# Altium project Smoke_Detector.PrjPcb (part 4 of 4)
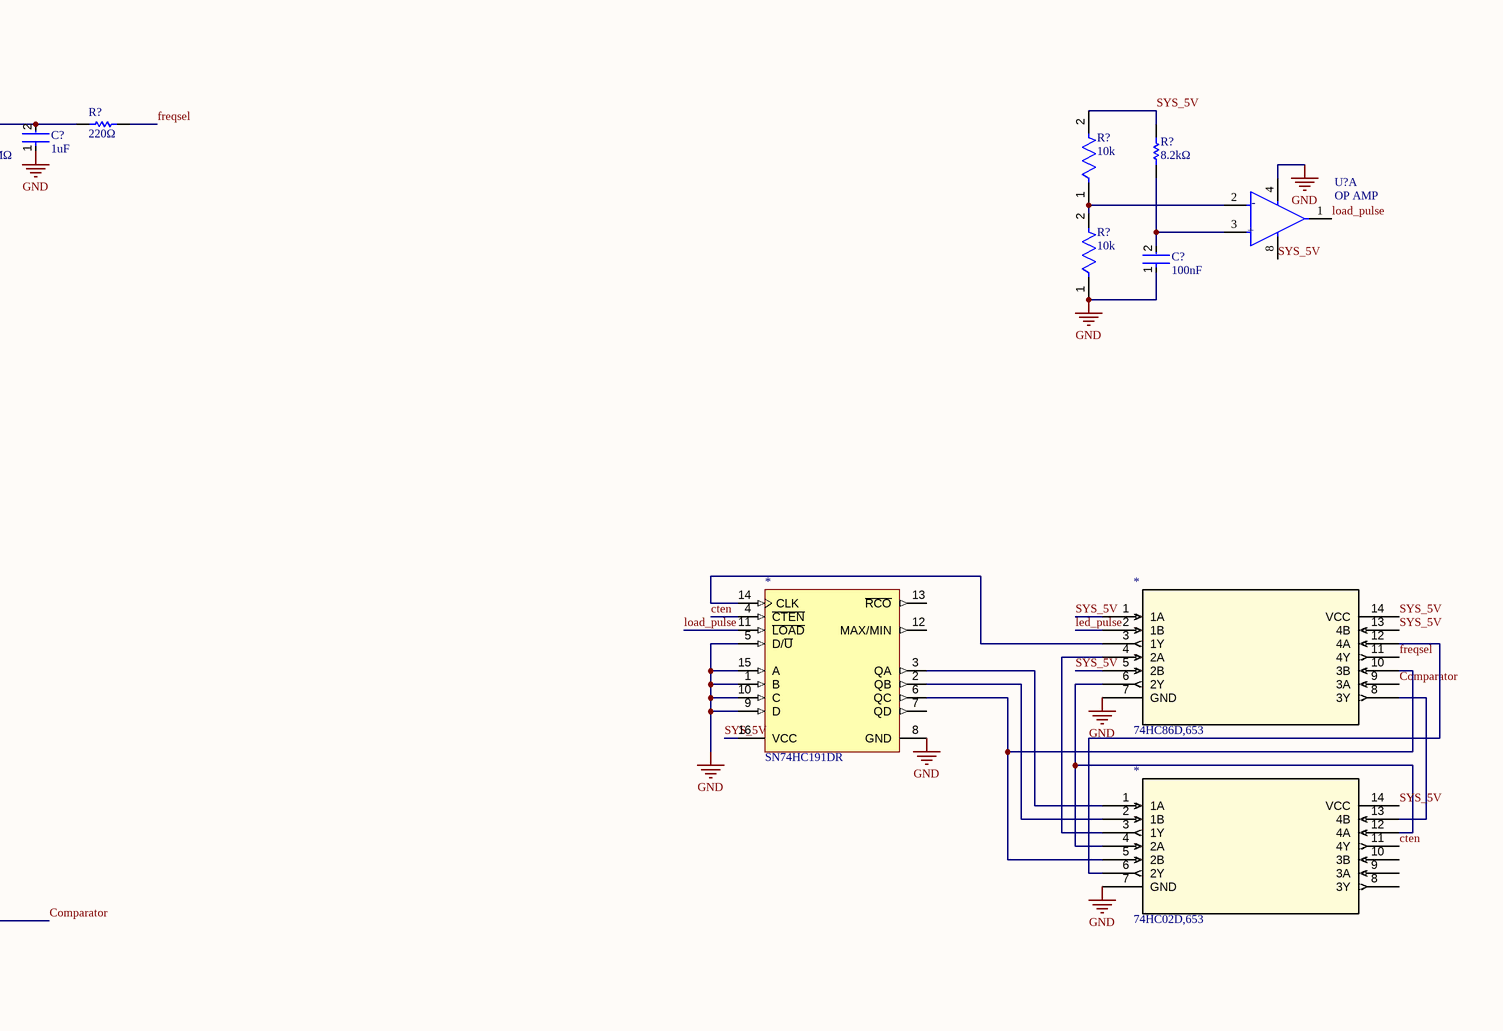
[diagram p4: Sheet1.SchDoc, right]

## Sheet Sheet1.SchDoc (continued)

### Library data of the parts (continued)
R?#8 R?#13 R?#22 R?#23 R?#27 R?#29 R?#30 = CRCW080510K0FKEA: RES SMD 10K OHM 1% 1/8W 0805; Manufacturer: Vishay; Manufacturer Package Identifier: CRCW0805-e3; Power Rating: 125mW; Value: 10kΩ; Temperature Coefficient: 100ppm/°C; Voltage Rating: 150V; Supplier: Future Electronics; Supplier Part Number: CRCW080510K0FKEA; Manufacturer Part Number: CRCW080510K0FKEA; RoHS: Compliant; Category: Chip SMD Resistors; Stock: 5460000; Pricing: 10000=0.0023, 50000=0.0022, 125000=0.0022, 375000=0.0021, 750000=0.002 (USD); Case/Package: 0805; Case Code (Imperial): 0805; China RoHS: Non-Compliant; Composition: Thick Film; Contact Plating: Tin; Country of Origin: Israel; Depth: 1.25mm; Export Control Classification Number (ECCN) Code: EAR99; Height: 450µm; Harmonized Tariff Schedule (HTS) Code: 8533.21.00.30; Introduction Date: 2005-02-16; Lead Free: Lead Free; Length: 2mm; Lifecycle Status: Production; Max Operating Temperature: 155°C; Military Standard: Not; Min Operating Temperature: -55°C; Mounting Technology: Surface Mount; Pins: 2; Number of Terminals: 2; Packaging: Cut Tape; Radiation Hardening: No; Ratings: AEC-Q200; REACH SVHC: Unaffected; Schedule B: 8533210045, 8533210045|8533210045|8533210045|8533210045|8533210045|8533210045|8533210045|8533210045|8533210045|8533210045|8533210045|8533210045|8533210045|8533210045|8533210045|8533210045|8533210045|8533210045|8533210045|8533210045|8533210045|8533210045|8533210045|85; Termination: SMD/SMT; Tolerance: 1%; Voltage Rating (DC): 150V; Weight: 5.499807mg; Width: 1.25mm; Working Voltage: 150V; ComponentLink1URL: https://datasheet.octopart.com:443/CRCW080510K0FKEA-Vishay-datasheet-175423584.pdf?src-supplier=IHS; ComponentLink1Description: https://datasheet.octopart.com:443/CRCW080510K0FKEA-Vishay-datasheet-175423584.pdf?src-supplier=IHS; ComponentLink2URL: https://datasheet.octopart.com:443/CRCW080510K0FKEA-Vishay-datasheet-5300368.pdf?src-supplier=Future+Electronics; ComponentLink2Description: https://datasheet.octopart.com:443/CRCW080510K0FKEA-Vishay-datasheet-5300368.pdf?src-supplier=Future+Electronics; ComponentLink3URL: https://datasheet.octopart.com:443/CRCW080510K0FKEA-Vishay-datasheet-62316122.pdf?src-supplier=Future+Electronics; ComponentLink3Description: https://datasheet.octopart.com:443/CRCW080510K0FKEA-Vishay-datasheet-62316122.pdf?src-supplier=Future+Electronics; ComponentLink4URL: https://datasheet.octopart.com:443/CRCW080510K0FKEA-Vishay-datasheet-83961561.pdf?src-supplier=Newark; ComponentLink4Description: https://datasheet.octopart.com:443/CRCW080510K0FKEA-Vishay-datasheet-83961561.pdf?src-supplier=Newark; ComponentLink5URL: https://datasheet.octopart.com:443/CRCW080510K0FKEA-Vishay-datasheet-14722531.pdf?src-supplier=Newark; ComponentLink5Description: https://datasheet.octopart.com:443/CRCW080510K0FKEA-Vishay-datasheet-14722531.pdf?src-supplier=Newark; ComponentLink6URL: https://datasheet.octopart.com:443/CRCW080510K0FKEA-Vishay-datasheet-62317937.pdf?src-supplier=Newark; ComponentLink6Description: https://datasheet.octopart.com:443/CRCW080510K0FKEA-Vishay-datasheet-62317937.pdf?src-supplier=Newark; ComponentLink7URL: https://datasheet.octopart.com:443/CRCW080510K0FKEA-Vishay-datasheet-11516975.pdf?src-supplier=Newark; ComponentLink7Description: https://datasheet.octopart.com:443/CRCW080510K0FKEA-Vishay-datasheet-11516975.pdf?src-supplier=Newark; ComponentLink8URL: https://datasheet.octopart.com:443/CRCW080510K0FKEA-Vishay-datasheet-183883877.pdf?src-supplier=Newark; ComponentLink8Description: https://datasheet.octopart.com:443/CRCW080510K0FKEA-Vishay-datasheet-183883877.pdf?src-supplier=Newark; ComponentLink9URL: https://datasheet.octopart.com:443/CRCW080510K0FKEA-Vishay-datasheet-41302739.pdf?src-supplier=Newark; ComponentLink9Description: https://datasheet.octopart.com:443/CRCW080510K0FKEA-Vishay-datasheet-41302739.pdf?src-supplier=Newark; ComponentLink10URL: https://datasheet.octopart.com:443/CRCW080510K0FKEA-Vishay-datasheet-27121962.pdf?src-supplier=Newark; ComponentLink10Description: https://datasheet.octopart.com:443/CRCW080510K0FKEA-Vishay-datasheet-27121962.pdf?src-supplier=Newark; ComponentLink11URL: https://datasheet.octopart.com:443/CRCW080510K0FKEA-Vishay-datasheet-16179825.pdf?src-supplier=element14+APAC; ComponentLink11Description: https://datasheet.octopart.com:443/CRCW080510K0FKEA-Vishay-datasheet-16179825.pdf?src-supplier=element14+APAC; ComponentLink12URL: https://datasheet.octopart.com:443/CRCW080510K0FKEA-Vishay-datasheet-66077789.pdf?src-supplier=element14+APAC; ComponentLink12Description: https://datasheet.octopart.com:443/CRCW080510K0FKEA-Vishay-datasheet-66077789.pdf?src-supplier=element14+APAC; ComponentLink13URL: https://datasheet.octopart.com:443/CRCW080510K0FKEA-Vishay-datasheet-5306405.pdf?src-supplier=RS+(Formerly+Allied+Electronics); ComponentLink13Description: https://datasheet.octopart.com:443/CRCW080510K0FKEA-Vishay-datasheet-5306405.pdf?src-supplier=RS+(Formerly+Allied+Electronics); ComponentLink14URL: https://datasheet.octopart.com:443/CRCW080510K0FKEA-Vishay-Dale-datasheet-47688880.pdf?src-supplier=RS+(Formerly+Allied+Electronics); ComponentLink14Description: https://datasheet.octopart.com:443/CRCW080510K0FKEA-Vishay-Dale-datasheet-47688880.pdf?src-supplier=RS+(Formerly+Allied+Electronics); ComponentLink15URL: https://datasheet.octopart.com:443/CRCW080510K0FKEA-Vishay-datasheet-12001583.pdf?src-supplier=RS+(Formerly+Allied+Electronics); ComponentLink15Description: https://datasheet.octopart.com:443/CRCW080510K0FKEA-Vishay-datasheet-12001583.pdf?src-supplier=RS+(Formerly+Allied+Electronics); ComponentLink16URL: https://datasheet.octopart.com:443/CRCW080510K0FKEA-Vishay-datasheet-17834126.pdf?src-supplier=TME; ComponentLink16Description: https://datasheet.octopart.com:443/CRCW080510K0FKEA-Vishay-datasheet-17834126.pdf?src-supplier=TME; ComponentLink17URL: https://datasheet.octopart.com/D-CRCW-e3-Standard-Thick-Film-Chip-Resistors-Vishay-datasheet-family-64.pdf; ComponentLink17Description: https://datasheet.octopart.com/D-CRCW-e3-Standard-Thick-Film-Chip-Resistors-Vishay-datasheet-family-64.pdf; ComponentLink18URL: https://datasheet.octopart.com:443/CRCW080510K0FKEA-Vishay-datasheet-13242068.pdf?src-supplier=Farnell; ComponentLink18Description: https://datasheet.octopart.com:443/CRCW080510K0FKEA-Vishay-datasheet-13242068.pdf?src-supplier=Farnell; ComponentLink19URL: https://datasheet.octopart.com:443/CRCW080510K0FKEA-Vishay-datasheet-13195083.pdf?src-supplier=Farnell; ComponentLink19Description: https://datasheet.octopart.com:443/CRCW080510K0FKEA-Vishay-datasheet-13195083.pdf?src-supplier=Farnell; ComponentLink20URL: https://datasheet.octopart.com:443/CRCW080510K0FKEA-Vishay-datasheet-13034211.pdf?src-supplier=Farnell; ComponentLink20Description: https://datasheet.octopart.com:443/CRCW080510K0FKEA-Vishay-datasheet-13034211.pdf?src-supplier=Farnell; ComponentLink21URL: https://datasheet.octopart.com:443/CRCW080510K0FKEA-Vishay-datasheet-12600034.pdf?src-supplier=Farnell; ComponentLink21Description: https://datasheet.octopart.com:443/CRCW080510K0FKEA-Vishay-datasheet-12600034.pdf?src-supplier=Farnell; ComponentLink22URL: https://datasheet.octopart.com:443/CRCW080510K0FKEA-Vishay-datasheet-12532161.pdf?src-supplier=Farnell; ComponentLink22Description: https://datasheet.octopart.com:443/CRCW080510K0FKEA-Vishay-datasheet-12532161.pdf?src-supplier=Farnell; ComponentLink23URL: https://datasheet.octopart.com:443/CRCW080510K0FKEA-Vishay-datasheet-12517896.pdf?src-supplier=Farnell; ComponentLink23Description: https://datasheet.octopart.com:443/CRCW080510K0FKEA-Vishay-datasheet-12517896.pdf?src-supplier=Farnell; ComponentLink24URL: https://datasheet.octopart.com:443/CRCW080510K0FKEA-Vishay-datasheet-12509762.pdf?src-supplier=Farnell; ComponentLink24Description: https://datasheet.octopart.com:443/CRCW080510K0FKEA-Vishay-datasheet-12509762.pdf?src-supplier=Farnell; ComponentLink25URL: https://datasheet.octopart.com:443/CRCW080510K0FKEA-Vishay-datasheet-10322335.pdf?src-supplier=Farnell; ComponentLink25Description: https://datasheet.octopart.com:443/CRCW080510K0FKEA-Vishay-datasheet-10322335.pdf?src-supplier=Farnell; ComponentLink26URL: https://datasheet.octopart.com:443/CRCW080510K0FKEA-Vishay-datasheet-8788789.pdf?src-supplier=Farnell; ComponentLink26Description: https://datasheet.octopart.com:443/CRCW080510K0FKEA-Vishay-datasheet-8788789.pdf?src-supplier=Farnell; ComponentLink27URL: https://datasheet.octopart.com:443/CRCW080510K0FKEA-Vishay-datasheet-8361388.pdf?src-supplier=Farnell; ComponentLink27Description: https://datasheet.octopart.com:443/CRCW080510K0FKEA-Vishay-datasheet-8361388.pdf?src-supplier=Farnell; ComponentLink28URL: https://datasheet.octopart.com:443/CRCW080510K0FKEA-Vishay-datasheet-546287.pdf?src-supplier=Farnell; ComponentLink28Description: https://datasheet.octopart.com:443/CRCW080510K0FKEA-Vishay-datasheet-546287.pdf?src-supplier=Farnell; ComponentLink29URL: https://datasheet.octopart.com:443/CRCW080510K0FKEA-Vishay-datasheet-11540273.pdf?src-supplier=Arrow+Electronics; ComponentLink29Description: https://datasheet.octopart.com:443/CRCW080510K0FKEA-Vishay-datasheet-11540273.pdf?src-supplier=Arrow+Electronics; ComponentLink30URL: https://datasheet.octopart.com:443/CRCW080510K0FKEA-Vishay-datasheet-8445837.pdf?src-supplier=element14; ComponentLink30Description: https://datasheet.octopart.com:443/CRCW080510K0FKEA-Vishay-datasheet-8445837.pdf?src-supplier=element14; ComponentLink31URL: https://datasheet.octopart.com:443/CRCW080510K0FKEA-Vishay-datasheet-5377306.pdf?src-supplier=Garrett; ComponentLink31Description: https://datasheet.octopart.com:443/CRCW080510K0FKEA-Vishay-datasheet-5377306.pdf?src-supplier=Garrett; ComponentLink32URL: https://datasheet.octopart.com:443/CRCW080510K0FKEA-Vishay-datasheet-148188.pdf?src-supplier=Garrett; ComponentLink32Description: https://datasheet.octopart.com:443/CRCW080510K0FKEA-Vishay-datasheet-148188.pdf?src-supplier=Garrett; ComponentLink33URL: https://datasheet.octopart.com:443/CRCW080510K0FKEA-Vishay-datasheet-34203.pdf?src-supplier=Garrett; ComponentLink33Description: https://datasheet.octopart.com:443/CRCW080510K0FKEA-Vishay-datasheet-34203.pdf?src-supplier=Garrett; ComponentLink34URL: http://sigma.octopart.com:80/rohs_certificate/D-CRCW-e3-Standard-Thick-Film-Chip-Resistors-Vishay-family-102.pdf?src-supplier=Compliance+Statements; ComponentLink34Description: http://sigma.octopart.com:80/rohs_certificate/D-CRCW-e3-Standard-Thick-Film-Chip-Resistors-Vishay-family-102.pdf?src-supplier=Compliance+Statements
R?#9 = RC0805FR-07470RL: RES SMD 470 OHM 1% 1/8W 0805; Manufacturer: Yageo Group; Max Power Dissipation: 125mW; Value: 470Ω; Temperature Coefficient: 100ppm/°C; Voltage Rating: 150V; Supplier: Future Electronics; Supplier Part Number: RC0805FR-07470RL; Manufacturer Part Number: RC0805FR-07470RL; RoHS: Compliant; Category: Chip SMD Resistors; Stock: 335000; Pricing: 5000=0.0068, 20000=0.0066, 75000=0.0064, 150000=0.0063, 375000=0.006 (USD); Case/Package: 0805; Case Code (Imperial): 0805; China RoHS: Non-Compliant; Composition: Thick Film; Contact Plating: Tin; Country of Origin: Mainland China, Taiwan; Depth: 1.25mm; Export Control Classification Number (ECCN) Code: EAR99; Features: Moisture Resistant; Height: 500µm; Harmonized Tariff Schedule (HTS) Code: 8533.21.00.30; Introduction Date: 2004-09-22; Lead Free: Lead Free; Lead Pitch: 400µm; Length: 2mm; Lifecycle Status: Production; Max Operating Temperature: 155°C; Military Standard: Not; Min Operating Temperature: -55°C; Mounting Technology: Surface Mount; Pins: 2; Number of Terminals: 2; Number of Terminations: 2; Packaging: Tape & Reel; Power Rating: 125mW; Radiation Hardening: No; REACH SVHC: Unaffected; Schedule B: 8533210045, 8533210045|8533210045|8533210045|8533210045|8533210045|8533210045|8533210045|8533210045|8533210045|8533210045|8533210045|8533210045|8533210045|8533210045|8533210045|8533210045|8533210045|8533210045|8533210045|8533210045|8533210045|8533210045|8533210045|85; Termination: SMD/SMT; Tolerance: 1%; Voltage Rating (AC): 150V; Voltage Rating (DC): 150V; Width: 1.25mm; Working Voltage: 150V; ComponentLink1URL: https://datasheet.octopart.com:443/RC0805FR-07470RL-Yageo-datasheet-175887523.pdf?src-supplier=Newark; ComponentLink1Description: https://datasheet.octopart.com:443/RC0805FR-07470RL-Yageo-datasheet-175887523.pdf?src-supplier=Newark; ComponentLink2URL: https://datasheet.octopart.com:443/RC0805FR-07470RL-Yageo-Group-datasheet-190051977.pdf?src-supplier=Newark; ComponentLink2Description: https://datasheet.octopart.com:443/RC0805FR-07470RL-Yageo-Group-datasheet-190051977.pdf?src-supplier=Newark; ComponentLink3URL: https://datasheet.octopart.com:443/RC0805FR-07470RL-Yageo-datasheet-103092701.pdf?src-supplier=Upverter; ComponentLink3Description: https://datasheet.octopart.com:443/RC0805FR-07470RL-Yageo-datasheet-103092701.pdf?src-supplier=Upverter; ComponentLink4URL: https://datasheet.octopart.com:443/RC0805FR-07470RL-Yageo-datasheet-98239111.pdf?src-supplier=Upverter; ComponentLink4Description: https://datasheet.octopart.com:443/RC0805FR-07470RL-Yageo-datasheet-98239111.pdf?src-supplier=Upverter; ComponentLink5URL: https://datasheet.octopart.com:443/RC0805FR-07470RL-Yageo-datasheet-8330313.pdf?src-supplier=element14+APAC; ComponentLink5Description: https://datasheet.octopart.com:443/RC0805FR-07470RL-Yageo-datasheet-8330313.pdf?src-supplier=element14+APAC; ComponentLink6URL: https://datasheet.octopart.com:443/RC0805FR-07470RL-Yageo-datasheet-62067350.pdf?src-supplier=Farnell; ComponentLink6Description: https://datasheet.octopart.com:443/RC0805FR-07470RL-Yageo-datasheet-62067350.pdf?src-supplier=Farnell; ComponentLink7URL: https://datasheet.octopart.com:443/RC0805FR-07470RL-Yageo-datasheet-13691069.pdf?src-supplier=Farnell; ComponentLink7Description: https://datasheet.octopart.com:443/RC0805FR-07470RL-Yageo-datasheet-13691069.pdf?src-supplier=Farnell; ComponentLink8URL: https://datasheet.octopart.com:443/RC0805FR-07470RL-Yageo-Group-datasheet-176638170.pdf?src-supplier=Future+Electronics; ComponentLink8Description: https://datasheet.octopart.com:443/RC0805FR-07470RL-Yageo-Group-datasheet-176638170.pdf?src-supplier=Future+Electronics; ComponentLink9URL: https://datasheet.octopart.com:443/RC0805FR-07470RL-Yageo-datasheet-164759695.pdf?src-supplier=Future+Electronics; ComponentLink9Description: https://datasheet.octopart.com:443/RC0805FR-07470RL-Yageo-datasheet-164759695.pdf?src-supplier=Future+Electronics; ComponentLink10URL: https://datasheet.octopart.com:443/RC0805FR-07470RL-Yageo-datasheet-12592811.pdf?src-supplier=Future+Electronics; ComponentLink10Description: https://datasheet.octopart.com:443/RC0805FR-07470RL-Yageo-datasheet-12592811.pdf?src-supplier=Future+Electronics; ComponentLink11URL: https://datasheet.octopart.com:443/RC0805FR-07470RL-Yageo-datasheet-8324252.pdf?src-supplier=Future+Electronics; ComponentLink11Description: https://datasheet.octopart.com:443/RC0805FR-07470RL-Yageo-datasheet-8324252.pdf?src-supplier=Future+Electronics; ComponentLink12URL: https://datasheet.octopart.com:443/RC0805FR-07470RL-Yageo-datasheet-79472498.pdf?src-supplier=Megastar; ComponentLink12Description: https://datasheet.octopart.com:443/RC0805FR-07470RL-Yageo-datasheet-79472498.pdf?src-supplier=Megastar; ComponentLink13URL: https://datasheet.octopart.com/RC0805FR-07470RL-Yageo-datasheet-73766026.pdf; ComponentLink13Description: https://datasheet.octopart.com/RC0805FR-07470RL-Yageo-datasheet-73766026.pdf; ComponentLink14URL: https://datasheet.octopart.com:443/RC0805FR-07470RL-Yageo-datasheet-118657.pdf?src-supplier=DigiKey; ComponentLink14Description: https://datasheet.octopart.com:443/RC0805FR-07470RL-Yageo-datasheet-118657.pdf?src-supplier=DigiKey; ComponentLink15URL: https://datasheet.octopart.com:443/RC0805FR-07470RL-Yageo-datasheet-502840.pdf?src-supplier=element14; ComponentLink15Description: https://datasheet.octopart.com:443/RC0805FR-07470RL-Yageo-datasheet-502840.pdf?src-supplier=element14; ComponentLink16URL: http://sigma.octopart.com:80/conflict_mineral_statement/Yageo-company-3.pdf?src-supplier=Compliance+Statements; ComponentLink16Description: http://sigma.octopart.com:80/conflict_mineral_statement/Yageo-company-3.pdf?src-supplier=Compliance+Statements; ComponentLink17URL: http://sigma.octopart.com:80/rohs_statement/Yageo-company-2.pdf?src-supplier=Compliance+Statements; ComponentLink17Description: http://sigma.octopart.com:80/rohs_statement/Yageo-company-2.pdf?src-supplier=Compliance+Statements
R?#14 R?#18 R?#26 = CRCW0805100RFKEA: RES 100Ω ±1% 125mW 0805; Manufacturer: Vishay; Manufacturer Package Identifier: CRCW0805-e3; Temperature Coefficient: 100ppm/°C; Voltage Rating: 150V; Supplier: Future Electronics; Supplier Part Number: CRCW0805100RFKEA; Manufacturer Part Number: CRCW0805100RFKEA; RoHS: Compliant; Category: Chip SMD Resistors; Stock: 3045000; Pricing: 10000=0.0023, 50000=0.0022, 125000=0.0021, 375000=0.0021, 750000=0.002 (USD); Case/Package: 0805; Case Code (Imperial): 0805; China RoHS: Non-Compliant; Composition: Thick Film; Contact Plating: Tin; Country of Origin: Israel; Depth: 1.25mm; Export Control Classification Number (ECCN) Code: EAR99; Features: Automotive AEC-Q200; Height: 450µm; Harmonized Tariff Schedule (HTS) Code: 8533.21.00.30; Introduction Date: 2005-02-16; Lead Free: Lead Free; Length: 2mm; Lifecycle Status: Production; Max Operating Temperature: 155°C; Max Power Dissipation: 125mW; Military Standard: Not; Min Operating Temperature: -55°C; Mounting Technology: Surface Mount; Pins: 2; Number of Terminals: 2; Number of Terminations: 2; Power Rating: 125mW; Radiation Hardening: No; Ratings: AEC-Q200; REACH SVHC: Unaffected; Value: 100Ω; Schedule B: 8533210045, 8533210045|8533210045|8533210045|8533210045|8533210045|8533210045|8533210045|8533210045|8533210045|8533210045|8533210045|8533210045|8533210045|8533210045|8533210045|8533210045|8533210045|8533210045|8533210045|8533210045|8533210045|8533210045|8533210045|85; Termination: SMD/SMT; Tolerance: 1%; Voltage Rating (DC): 150V; Weight: 5.499807mg; Width: 1.25mm; Working Voltage: 150V; ComponentLink1URL: https://datasheet.octopart.com:443/CRCW0805100RFKEA-Vishay-datasheet-175423584.pdf?src-supplier=IHS; ComponentLink1Description: https://datasheet.octopart.com:443/CRCW0805100RFKEA-Vishay-datasheet-175423584.pdf?src-supplier=IHS; ComponentLink2URL: https://datasheet.octopart.com:443/CRCW0805100RFKEA-Vishay-datasheet-83961561.pdf?src-supplier=Newark; ComponentLink2Description: https://datasheet.octopart.com:443/CRCW0805100RFKEA-Vishay-datasheet-83961561.pdf?src-supplier=Newark; ComponentLink3URL: https://datasheet.octopart.com:443/CRCW0805100RFKEA-Vishay-datasheet-11516975.pdf?src-supplier=Newark; ComponentLink3Description: https://datasheet.octopart.com:443/CRCW0805100RFKEA-Vishay-datasheet-11516975.pdf?src-supplier=Newark; ComponentLink4URL: https://datasheet.octopart.com:443/CRCW0805100RFKEA-Vishay-datasheet-41302739.pdf?src-supplier=Newark; ComponentLink4Description: https://datasheet.octopart.com:443/CRCW0805100RFKEA-Vishay-datasheet-41302739.pdf?src-supplier=Newark; ComponentLink5URL: https://datasheet.octopart.com:443/CRCW0805100RFKEA-Vishay-datasheet-33013972.pdf?src-supplier=Newark; ComponentLink5Description: https://datasheet.octopart.com:443/CRCW0805100RFKEA-Vishay-datasheet-33013972.pdf?src-supplier=Newark; ComponentLink6URL: https://datasheet.octopart.com:443/CRCW0805100RFKEA-Vishay-datasheet-62317937.pdf?src-supplier=element14+APAC; ComponentLink6Description: https://datasheet.octopart.com:443/CRCW0805100RFKEA-Vishay-datasheet-62317937.pdf?src-supplier=element14+APAC; ComponentLink7URL: https://datasheet.octopart.com:443/CRCW0805100RFKEA-Vishay-datasheet-14722531.pdf?src-supplier=element14+APAC; ComponentLink7Description: https://datasheet.octopart.com:443/CRCW0805100RFKEA-Vishay-datasheet-14722531.pdf?src-supplier=element14+APAC; ComponentLink8URL: https://datasheet.octopart.com:443/CRCW0805100RFKEA.-Vishay-datasheet-78776209.pdf?src-supplier=element14+APAC; ComponentLink8Description: https://datasheet.octopart.com:443/CRCW0805100RFKEA.-Vishay-datasheet-78776209.pdf?src-supplier=element14+APAC; ComponentLink9URL: https://datasheet.octopart.com:443/CRCW0805100RFKEA-Vishay-datasheet-66077789.pdf?src-supplier=element14+APAC; ComponentLink9Description: https://datasheet.octopart.com:443/CRCW0805100RFKEA-Vishay-datasheet-66077789.pdf?src-supplier=element14+APAC; ComponentLink10URL: https://datasheet.octopart.com:443/CRCW0805100RFKEA-Vishay-datasheet-16179825.pdf?src-supplier=element14+APAC; ComponentLink10Description: https://datasheet.octopart.com:443/CRCW0805100RFKEA-Vishay-datasheet-16179825.pdf?src-supplier=element14+APAC; ComponentLink11URL: https://datasheet.octopart.com:443/CRCW0805100RFKEA-Vishay-datasheet-5300368.pdf?src-supplier=Future+Electronics; ComponentLink11Description: https://datasheet.octopart.com:443/CRCW0805100RFKEA-Vishay-datasheet-5300368.pdf?src-supplier=Future+Electronics; ComponentLink12URL: https://datasheet.octopart.com:443/CRCW0805100RFKEA-Vishay-datasheet-62316122.pdf?src-supplier=Future+Electronics; ComponentLink12Description: https://datasheet.octopart.com:443/CRCW0805100RFKEA-Vishay-datasheet-62316122.pdf?src-supplier=Future+Electronics; ComponentLink13URL: https://datasheet.octopart.com:443/CRCW0805100RFKEA-Vishay-datasheet-5306405.pdf?src-supplier=RS+(Formerly+Allied+Electronics); ComponentLink13Description: https://datasheet.octopart.com:443/CRCW0805100RFKEA-Vishay-datasheet-5306405.pdf?src-supplier=RS+(Formerly+Allied+Electronics); ComponentLink14URL: https://datasheet.octopart.com:443/CRCW0805100RFKEA-Vishay-Dale-datasheet-47688880.pdf?src-supplier=RS+(Formerly+Allied+Electronics); ComponentLink14Description: https://datasheet.octopart.com:443/CRCW0805100RFKEA-Vishay-Dale-datasheet-47688880.pdf?src-supplier=RS+(Formerly+Allied+Electronics); ComponentLink15URL: https://datasheet.octopart.com:443/CRCW0805100RFKEA-Vishay-datasheet-12001583.pdf?src-supplier=RS+(Formerly+Allied+Electronics); ComponentLink15Description: https://datasheet.octopart.com:443/CRCW0805100RFKEA-Vishay-datasheet-12001583.pdf?src-supplier=RS+(Formerly+Allied+Electronics); ComponentLink16URL: https://datasheet.octopart.com:443/CRCW0805100RFKEA-Vishay-datasheet-149165818.pdf?src-supplier=HQonline; ComponentLink16Description: https://datasheet.octopart.com:443/CRCW0805100RFKEA-Vishay-datasheet-149165818.pdf?src-supplier=HQonline; ComponentLink17URL: https://datasheet.octopart.com:443/CRCW0805100RFKEA-Vishay-datasheet-17834126.pdf?src-supplier=TME; ComponentLink17Description: https://datasheet.octopart.com:443/CRCW0805100RFKEA-Vishay-datasheet-17834126.pdf?src-supplier=TME; ComponentLink18URL: https://datasheet.octopart.com:443/CRCW0805100RFKEA-Vishay-datasheet-13242068.pdf?src-supplier=Farnell; ComponentLink18Description: https://datasheet.octopart.com:443/CRCW0805100RFKEA-Vishay-datasheet-13242068.pdf?src-supplier=Farnell; ComponentLink19URL: https://datasheet.octopart.com:443/CRCW0805100RFKEA-Vishay-datasheet-13195083.pdf?src-supplier=Farnell; ComponentLink19Description: https://datasheet.octopart.com:443/CRCW0805100RFKEA-Vishay-datasheet-13195083.pdf?src-supplier=Farnell; ComponentLink20URL: https://datasheet.octopart.com:443/CRCW0805100RFKEA-Vishay-datasheet-13034211.pdf?src-supplier=Farnell; ComponentLink20Description: https://datasheet.octopart.com:443/CRCW0805100RFKEA-Vishay-datasheet-13034211.pdf?src-supplier=Farnell; ComponentLink21URL: https://datasheet.octopart.com:443/CRCW0805100RFKEA-Vishay-datasheet-12600034.pdf?src-supplier=Farnell; ComponentLink21Description: https://datasheet.octopart.com:443/CRCW0805100RFKEA-Vishay-datasheet-12600034.pdf?src-supplier=Farnell; ComponentLink22URL: https://datasheet.octopart.com:443/CRCW0805100RFKEA-Vishay-datasheet-12532161.pdf?src-supplier=Farnell; ComponentLink22Description: https://datasheet.octopart.com:443/CRCW0805100RFKEA-Vishay-datasheet-12532161.pdf?src-supplier=Farnell; ComponentLink23URL: https://datasheet.octopart.com:443/CRCW0805100RFKEA-Vishay-datasheet-12517896.pdf?src-supplier=Farnell; ComponentLink23Description: https://datasheet.octopart.com:443/CRCW0805100RFKEA-Vishay-datasheet-12517896.pdf?src-supplier=Farnell; ComponentLink24URL: https://datasheet.octopart.com:443/CRCW0805100RFKEA-Vishay-datasheet-12509762.pdf?src-supplier=Farnell; ComponentLink24Description: https://datasheet.octopart.com:443/CRCW0805100RFKEA-Vishay-datasheet-12509762.pdf?src-supplier=Farnell; ComponentLink25URL: https://datasheet.octopart.com:443/CRCW0805100RFKEA-Vishay-datasheet-10322335.pdf?src-supplier=Farnell; ComponentLink25Description: https://datasheet.octopart.com:443/CRCW0805100RFKEA-Vishay-datasheet-10322335.pdf?src-supplier=Farnell; ComponentLink26URL: https://datasheet.octopart.com:443/CRCW0805100RFKEA-Vishay-datasheet-8788789.pdf?src-supplier=Farnell; ComponentLink26Description: https://datasheet.octopart.com:443/CRCW0805100RFKEA-Vishay-datasheet-8788789.pdf?src-supplier=Farnell; ComponentLink27URL: https://datasheet.octopart.com:443/CRCW0805100RFKEA-Vishay-datasheet-8361388.pdf?src-supplier=Farnell; ComponentLink27Description: https://datasheet.octopart.com:443/CRCW0805100RFKEA-Vishay-datasheet-8361388.pdf?src-supplier=Farnell; ComponentLink28URL: https://datasheet.octopart.com:443/CRCW0805100RFKEA-Vishay-datasheet-546287.pdf?src-supplier=Farnell; ComponentLink28Description: https://datasheet.octopart.com:443/CRCW0805100RFKEA-Vishay-datasheet-546287.pdf?src-supplier=Farnell; ComponentLink29URL: https://datasheet.octopart.com:443/CRCW0805100RFKEA-Vishay-datasheet-11540273.pdf?src-supplier=Arrow+Electronics; ComponentLink29Description: https://datasheet.octopart.com:443/CRCW0805100RFKEA-Vishay-datasheet-11540273.pdf?src-supplier=Arrow+Electronics; ComponentLink30URL: https://datasheet.octopart.com:443/CRCW0805100RFKEA-Vishay-datasheet-8445837.pdf?src-supplier=element14; ComponentLink30Description: https://datasheet.octopart.com:443/CRCW0805100RFKEA-Vishay-datasheet-8445837.pdf?src-supplier=element14; ComponentLink31URL: https://datasheet.octopart.com:443/CRCW0805100RFKEA-Vishay-datasheet-5377306.pdf?src-supplier=Garrett; ComponentLink31Description: https://datasheet.octopart.com:443/CRCW0805100RFKEA-Vishay-datasheet-5377306.pdf?src-supplier=Garrett; ComponentLink32URL: https://datasheet.octopart.com:443/CRCW0805100RFKEA-Vishay-datasheet-148188.pdf?src-supplier=Garrett; ComponentLink32Description: https://datasheet.octopart.com:443/CRCW0805100RFKEA-Vishay-datasheet-148188.pdf?src-supplier=Garrett; ComponentLink33URL: https://datasheet.octopart.com:443/CRCW0805100RFKEA-Vishay-datasheet-34203.pdf?src-supplier=Garrett; ComponentLink33Description: https://datasheet.octopart.com:443/CRCW0805100RFKEA-Vishay-datasheet-34203.pdf?src-supplier=Garrett; ComponentLink34URL: http://sigma.octopart.com:80/rohs_statement/Vishay-company-15.pdf?src-supplier=Compliance+Statements; ComponentLink34Description: http://sigma.octopart.com:80/rohs_statement/Vishay-company-15.pdf?src-supplier=Compliance+Statements
R?#21 = RC0805FR-07499KL: RES 499kΩ ±1% 125mW 0805; Manufacturer: Yageo Group; Temperature Coefficient: 100ppm/°C; Voltage Rating: 150V; Supplier: Future Electronics; Supplier Part Number: RC0805FR-07499KL; Manufacturer Part Number: RC0805FR-07499KL; RoHS: Compliant; Category: Chip SMD Resistors; Stock: 850000; Pricing: 5000=0.0068, 20000=0.0066, 75000=0.0064, 150000=0.0063, 375000=0.006 (USD); Case/Package: 0805; Case Code (Imperial): 0805; China RoHS: Non-Compliant; Composition: Thick Film; Contact Plating: Lead, Tin; Country of Origin: Mainland China, Taiwan; Depth: 1.25mm; Export Control Classification Number (ECCN) Code: EAR99; Height: 500µm; Harmonized Tariff Schedule (HTS) Code: 8533.21.00.30; Introduction Date: 2004-09-22; Lead Free: Lead Free; Length: 2mm; Lifecycle Status: Production; Max Operating Temperature: 155°C; Military Standard: Not; Min Operating Temperature: -55°C; Mounting Technology: Surface Mount; Number of Terminals: 2; Packaging: Tape & Reel; Power Rating: 125mW; Radiation Hardening: No; REACH SVHC: Unaffected; Value: 499kΩ; Schedule B: 8533210045, 8533210045|8533210045, 8533210045|8533210045|8533210045, 8533210045|8533210045|8533210045|8533210045; Termination: SMD/SMT; Tolerance: 1%; Voltage Rating (DC): 150V; Width: 1.25mm; Working Voltage: 150V; ComponentLink1URL: https://datasheet.octopart.com:443/RC0805FR-07499KL-Yageo-datasheet-175887523.pdf?src-supplier=Newark; ComponentLink1Description: https://datasheet.octopart.com:443/RC0805FR-07499KL-Yageo-datasheet-175887523.pdf?src-supplier=Newark; ComponentLink2URL: https://datasheet.octopart.com:443/RC0805FR-07499KL-Yageo-datasheet-103092701.pdf?src-supplier=Upverter; ComponentLink2Description: https://datasheet.octopart.com:443/RC0805FR-07499KL-Yageo-datasheet-103092701.pdf?src-supplier=Upverter; ComponentLink3URL: https://datasheet.octopart.com:443/RC0805FR-07499KL-Yageo-Group-datasheet-190305687.pdf?src-supplier=Future+Electronics; ComponentLink3Description: https://datasheet.octopart.com:443/RC0805FR-07499KL-Yageo-Group-datasheet-190305687.pdf?src-supplier=Future+Electronics; ComponentLink4URL: https://datasheet.octopart.com:443/RC0805FR-07499KL-Yageo-datasheet-164759695.pdf?src-supplier=Future+Electronics; ComponentLink4Description: https://datasheet.octopart.com:443/RC0805FR-07499KL-Yageo-datasheet-164759695.pdf?src-supplier=Future+Electronics; ComponentLink5URL: https://datasheet.octopart.com:443/RC0805FR-07499KL-Yageo-datasheet-12592811.pdf?src-supplier=Future+Electronics; ComponentLink5Description: https://datasheet.octopart.com:443/RC0805FR-07499KL-Yageo-datasheet-12592811.pdf?src-supplier=Future+Electronics; ComponentLink6URL: https://datasheet.octopart.com:443/RC0805FR-07499KL-Yageo-datasheet-8324252.pdf?src-supplier=Future+Electronics; ComponentLink6Description: https://datasheet.octopart.com:443/RC0805FR-07499KL-Yageo-datasheet-8324252.pdf?src-supplier=Future+Electronics; ComponentLink7URL: https://datasheet.octopart.com:443/RC0805FR-07499KL-Yageo-datasheet-8330313.pdf?src-supplier=TME; ComponentLink7Description: https://datasheet.octopart.com:443/RC0805FR-07499KL-Yageo-datasheet-8330313.pdf?src-supplier=TME; ComponentLink8URL: https://datasheet.octopart.com:443/RC0805FR-07499KL-Yageo-datasheet-79472498.pdf?src-supplier=Megastar; ComponentLink8Description: https://datasheet.octopart.com:443/RC0805FR-07499KL-Yageo-datasheet-79472498.pdf?src-supplier=Megastar; ComponentLink9URL: https://datasheet.octopart.com/RC0805FR-07499KL-Yageo-datasheet-73766026.pdf; ComponentLink9Description: https://datasheet.octopart.com/RC0805FR-07499KL-Yageo-datasheet-73766026.pdf; ComponentLink10URL: https://datasheet.octopart.com:443/RC0805FR-07499KL-Yageo-datasheet-118657.pdf?src-supplier=DigiKey; ComponentLink10Description: https://datasheet.octopart.com:443/RC0805FR-07499KL-Yageo-datasheet-118657.pdf?src-supplier=DigiKey; ComponentLink11URL: http://sigma.octopart.com:80/conflict_mineral_statement/Yageo-company-3.pdf?src-supplier=Compliance+Statements; ComponentLink11Description: http://sigma.octopart.com:80/conflict_mineral_statement/Yageo-company-3.pdf?src-supplier=Compliance+Statements; ComponentLink12URL: http://sigma.octopart.com:80/rohs_statement/Yageo-company-2.pdf?src-supplier=Compliance+Statements; ComponentLink12Description: http://sigma.octopart.com:80/rohs_statement/Yageo-company-2.pdf?src-supplier=Compliance+Statements; LCSC: C274360
R?#25 = CRCW080510R0FKEA: RES 10Ω ±1% 125mW 0805; Manufacturer: Vishay; Manufacturer Package Identifier: CRCW0805-e3; Temperature Coefficient: 100ppm/°C; Voltage Rating: 150V; Supplier: Future Electronics; Supplier Part Number: CRCW080510R0FKEA; Manufacturer Part Number: CRCW080510R0FKEA; RoHS: Compliant; Category: Chip SMD Resistors; Stock: 2860000; Pricing: 10000=0.0023, 50000=0.0022, 125000=0.0022, 375000=0.0021, 750000=0.002 (USD); Case/Package: 0805; Case Code (Imperial): 0805; China RoHS: Non-Compliant; Composition: Thick Film; Contact Plating: Lead, Tin; Country of Origin: Israel; Depth: 1.25mm; Export Control Classification Number (ECCN) Code: EAR99; Features: Automotive AEC-Q200; Height: 450µm; Harmonized Tariff Schedule (HTS) Code: 8533.21.00.30; Introduction Date: 2005-02-16; Lead Free: Lead Free; Length: 2mm; Lifecycle Status: Production; Max Operating Temperature: 155°C; Max Power Dissipation: 125mW; Military Standard: Not; Min Operating Temperature: -55°C; Mounting Technology: Surface Mount; Pins: 2; Number of Terminals: 2; Number of Terminations: 2; Packaging: Cut Tape; Power Rating: 125mW; Radiation Hardening: No; Ratings: AEC-Q200; REACH SVHC: Unaffected; Value: 10Ω; Schedule B: 8533210045, 8533210045|8533210045|8533210045|8533210045|8533210045|8533210045|8533210045|8533210045|8533210045|8533210045|8533210045|8533210045|8533210045|8533210045|8533210045|8533210045|8533210045|8533210045|8533210045|8533210045|8533210045|8533210045|8533210045|85; Termination: SMD/SMT; Tolerance: 1%; Voltage Rating (DC): 150V; Weight: 5.499807mg; Width: 1.25mm; Working Voltage: 150V; ComponentLink1URL: https://datasheet.octopart.com:443/CRCW080510R0FKEA-Vishay-datasheet-175423584.pdf?src-supplier=IHS; ComponentLink1Description: https://datasheet.octopart.com:443/CRCW080510R0FKEA-Vishay-datasheet-175423584.pdf?src-supplier=IHS; ComponentLink2URL: https://datasheet.octopart.com:443/CRCW080510R0FKEA-Vishay-datasheet-83961561.pdf?src-supplier=Newark; ComponentLink2Description: https://datasheet.octopart.com:443/CRCW080510R0FKEA-Vishay-datasheet-83961561.pdf?src-supplier=Newark; ComponentLink3URL: https://datasheet.octopart.com:443/CRCW080510R0FKEA-Vishay-datasheet-11516975.pdf?src-supplier=Newark; ComponentLink3Description: https://datasheet.octopart.com:443/CRCW080510R0FKEA-Vishay-datasheet-11516975.pdf?src-supplier=Newark; ComponentLink4URL: https://datasheet.octopart.com:443/CRCW080510R0FKEA-Vishay-datasheet-41302739.pdf?src-supplier=Newark; ComponentLink4Description: https://datasheet.octopart.com:443/CRCW080510R0FKEA-Vishay-datasheet-41302739.pdf?src-supplier=Newark; ComponentLink5URL: https://datasheet.octopart.com:443/CRCW080510R0FKEA-Vishay-datasheet-33013972.pdf?src-supplier=Newark; ComponentLink5Description: https://datasheet.octopart.com:443/CRCW080510R0FKEA-Vishay-datasheet-33013972.pdf?src-supplier=Newark; ComponentLink6URL: https://datasheet.octopart.com:443/CRCW080510R0FKEA-Vishay-datasheet-62317937.pdf?src-supplier=element14+APAC; ComponentLink6Description: https://datasheet.octopart.com:443/CRCW080510R0FKEA-Vishay-datasheet-62317937.pdf?src-supplier=element14+APAC; ComponentLink7URL: https://datasheet.octopart.com:443/CRCW080510R0FKEA-Vishay-datasheet-14722531.pdf?src-supplier=element14+APAC; ComponentLink7Description: https://datasheet.octopart.com:443/CRCW080510R0FKEA-Vishay-datasheet-14722531.pdf?src-supplier=element14+APAC; ComponentLink8URL: https://datasheet.octopart.com:443/CRCW080510R0FKEA.-Vishay-datasheet-78776209.pdf?src-supplier=element14+APAC; ComponentLink8Description: https://datasheet.octopart.com:443/CRCW080510R0FKEA.-Vishay-datasheet-78776209.pdf?src-supplier=element14+APAC; ComponentLink9URL: https://datasheet.octopart.com:443/CRCW080510R0FKEA-Vishay-datasheet-66077789.pdf?src-supplier=element14+APAC; ComponentLink9Description: https://datasheet.octopart.com:443/CRCW080510R0FKEA-Vishay-datasheet-66077789.pdf?src-supplier=element14+APAC; ComponentLink10URL: https://datasheet.octopart.com:443/CRCW080510R0FKEA-Vishay-datasheet-16179825.pdf?src-supplier=element14+APAC; ComponentLink10Description: https://datasheet.octopart.com:443/CRCW080510R0FKEA-Vishay-datasheet-16179825.pdf?src-supplier=element14+APAC; ComponentLink11URL: https://datasheet.octopart.com:443/CRCW080510R0FKEA-Vishay-datasheet-5306405.pdf?src-supplier=Future+Electronics; ComponentLink11Description: https://datasheet.octopart.com:443/CRCW080510R0FKEA-Vishay-datasheet-5306405.pdf?src-supplier=Future+Electronics; ComponentLink12URL: https://datasheet.octopart.com:443/CRCW080510R0FKEA-Vishay-datasheet-13242068.pdf?src-supplier=Future+Electronics; ComponentLink12Description: https://datasheet.octopart.com:443/CRCW080510R0FKEA-Vishay-datasheet-13242068.pdf?src-supplier=Future+Electronics; ComponentLink13URL: https://datasheet.octopart.com:443/CRCW080510R0FKEA-Vishay-datasheet-13195083.pdf?src-supplier=Future+Electronics; ComponentLink13Description: https://datasheet.octopart.com:443/CRCW080510R0FKEA-Vishay-datasheet-13195083.pdf?src-supplier=Future+Electronics; ComponentLink14URL: https://datasheet.octopart.com:443/CRCW080510R0FKEA-Vishay-datasheet-13034211.pdf?src-supplier=Future+Electronics; ComponentLink14Description: https://datasheet.octopart.com:443/CRCW080510R0FKEA-Vishay-datasheet-13034211.pdf?src-supplier=Future+Electronics; ComponentLink15URL: https://datasheet.octopart.com:443/CRCW080510R0FKEA-Vishay-datasheet-12600034.pdf?src-supplier=Future+Electronics; ComponentLink15Description: https://datasheet.octopart.com:443/CRCW080510R0FKEA-Vishay-datasheet-12600034.pdf?src-supplier=Future+Electronics; ComponentLink16URL: https://datasheet.octopart.com:443/CRCW080510R0FKEA-Vishay-datasheet-12532161.pdf?src-supplier=Future+Electronics; ComponentLink16Description: https://datasheet.octopart.com:443/CRCW080510R0FKEA-Vishay-datasheet-12532161.pdf?src-supplier=Future+Electronics; ComponentLink17URL: https://datasheet.octopart.com:443/CRCW080510R0FKEA-Vishay-datasheet-12509762.pdf?src-supplier=Future+Electronics; ComponentLink17Description: https://datasheet.octopart.com:443/CRCW080510R0FKEA-Vishay-datasheet-12509762.pdf?src-supplier=Future+Electronics; ComponentLink18URL: https://datasheet.octopart.com:443/CRCW080510R0FKEA-Vishay-datasheet-10322335.pdf?src-supplier=Future+Electronics; ComponentLink18Description: https://datasheet.octopart.com:443/CRCW080510R0FKEA-Vishay-datasheet-10322335.pdf?src-supplier=Future+Electronics; ComponentLink19URL: https://datasheet.octopart.com:443/CRCW080510R0FKEA-Vishay-datasheet-8788789.pdf?src-supplier=Future+Electronics; ComponentLink19Description: https://datasheet.octopart.com:443/CRCW080510R0FKEA-Vishay-datasheet-8788789.pdf?src-supplier=Future+Electronics; ComponentLink20URL: https://datasheet.octopart.com:443/CRCW080510R0FKEA-Vishay-datasheet-8361388.pdf?src-supplier=Future+Electronics; ComponentLink20Description: https://datasheet.octopart.com:443/CRCW080510R0FKEA-Vishay-datasheet-8361388.pdf?src-supplier=Future+Electronics; ComponentLink21URL: https://datasheet.octopart.com:443/CRCW080510R0FKEA-Vishay-datasheet-5300368.pdf?src-supplier=Future+Electronics; ComponentLink21Description: https://datasheet.octopart.com:443/CRCW080510R0FKEA-Vishay-datasheet-5300368.pdf?src-supplier=Future+Electronics; ComponentLink22URL: https://datasheet.octopart.com:443/CRCW080510R0FKEA-Vishay-datasheet-546287.pdf?src-supplier=Future+Electronics; ComponentLink22Description: https://datasheet.octopart.com:443/CRCW080510R0FKEA-Vishay-datasheet-546287.pdf?src-supplier=Future+Electronics; ComponentLink23URL: https://datasheet.octopart.com:443/CRCW080510R0FKEA-Vishay-datasheet-62316122.pdf?src-supplier=Future+Electronics; ComponentLink23Description: https://datasheet.octopart.com:443/CRCW080510R0FKEA-Vishay-datasheet-62316122.pdf?src-supplier=Future+Electronics; ComponentLink24URL: https://datasheet.octopart.com:443/CRCW080510R0FKEA-Vishay-datasheet-12517896.pdf?src-supplier=Farnell; ComponentLink24Description: https://datasheet.octopart.com:443/CRCW080510R0FKEA-Vishay-datasheet-12517896.pdf?src-supplier=Farnell; ComponentLink25URL: https://datasheet.octopart.com:443/CRCW080510R0FKEA-Vishay-datasheet-149165818.pdf?src-supplier=HQonline; ComponentLink25Description: https://datasheet.octopart.com:443/CRCW080510R0FKEA-Vishay-datasheet-149165818.pdf?src-supplier=HQonline; ComponentLink26URL: https://datasheet.octopart.com:443/CRCW080510R0FKEA-Vishay-Dale-datasheet-47688880.pdf?src-supplier=RS+(Formerly+Allied+Electronics); ComponentLink26Description: https://datasheet.octopart.com:443/CRCW080510R0FKEA-Vishay-Dale-datasheet-47688880.pdf?src-supplier=RS+(Formerly+Allied+Electronics); ComponentLink27URL: https://datasheet.octopart.com:443/CRCW080510R0FKEA-Vishay-datasheet-12001583.pdf?src-supplier=RS+(Formerly+Allied+Electronics); ComponentLink27Description: https://datasheet.octopart.com:443/CRCW080510R0FKEA-Vishay-datasheet-12001583.pdf?src-supplier=RS+(Formerly+Allied+Electronics); ComponentLink28URL: https://datasheet.octopart.com:443/CRCW080510R0FKEA-Vishay-datasheet-17834126.pdf?src-supplier=TME; ComponentLink28Description: https://datasheet.octopart.com:443/CRCW080510R0FKEA-Vishay-datasheet-17834126.pdf?src-supplier=TME; ComponentLink29URL: https://datasheet.octopart.com:443/CRCW080510R0FKEA-Vishay-datasheet-8445837.pdf?src-supplier=element14; ComponentLink29Description: https://datasheet.octopart.com:443/CRCW080510R0FKEA-Vishay-datasheet-8445837.pdf?src-supplier=element14; ComponentLink30URL: https://datasheet.octopart.com:443/CRCW080510R0FKEA-Vishay-datasheet-5377306.pdf?src-supplier=Garrett; ComponentLink30Description: https://datasheet.octopart.com:443/CRCW080510R0FKEA-Vishay-datasheet-5377306.pdf?src-supplier=Garrett; ComponentLink31URL: https://datasheet.octopart.com:443/CRCW080510R0FKEA-Vishay-datasheet-148188.pdf?src-supplier=Garrett; ComponentLink31Description: https://datasheet.octopart.com:443/CRCW080510R0FKEA-Vishay-datasheet-148188.pdf?src-supplier=Garrett; ComponentLink32URL: https://datasheet.octopart.com:443/CRCW080510R0FKEA-Vishay-datasheet-34203.pdf?src-supplier=Garrett; ComponentLink32Description: https://datasheet.octopart.com:443/CRCW080510R0FKEA-Vishay-datasheet-34203.pdf?src-supplier=Garrett; ComponentLink33URL: http://sigma.octopart.com:80/rohs_statement/Vishay-company-15.pdf?src-supplier=Compliance+Statements; ComponentLink33Description: http://sigma.octopart.com:80/rohs_statement/Vishay-company-15.pdf?src-supplier=Compliance+Statements
R?#28 = FRC0805J122 TS: RES 1.2kΩ ±5% 125mW 0805
R?#31 = FRC0805F68R0TS: RES 68Ω ±1% 125mW 0805
R?#32 = CRCW080522K0FKEAC: RES SMD 22K OHM 1% 1/8W 0805; Manufacturer: Vishay; Power Rating: 125mW; Value: 22kΩ; Temperature Coefficient: 100ppm/°C; Working Voltage: 150V; Supplier: Avnet; Supplier Part Number: CRCW080522K0FKEAC; Manufacturer Part Number: CRCW080522K0FKEAC; RoHS: Compliant; Category: Chip SMD Resistors; Stock: 85000; Pricing: 5000=0.00893, 100000=0.00478, 200000=0.00475, 400000=0.00473, 800000=0.0047 (USD); Case/Package: 0805; China RoHS: Non-Compliant; Composition: Thick Film; Contact Plating: Tin; Height: 500µm; Lead Free: Lead Free; Length: 2mm; Lifecycle Status: Production; Max Operating Temperature: 155°C; Min Operating Temperature: -55°C; Mounting Technology: Surface Mount; Number of Terminals: 2; REACH SVHC: Unaffected; Schedule B: 8533210045, 8533210045|8533210045|8533210045|8533210045|8533210045; Termination: Wraparound; Tolerance: 1%; Width: 1.25mm; ComponentLink1URL: https://datasheet.octopart.com:443/CRCW080522K0FKEAC-Vishay-datasheet-175423585.pdf?src-supplier=IHS; ComponentLink1Description: https://datasheet.octopart.com:443/CRCW080522K0FKEAC-Vishay-datasheet-175423585.pdf?src-supplier=IHS; ComponentLink2URL: https://datasheet.octopart.com:443/CRCW080522K0FKEAC-Vishay-datasheet-102570912.pdf?src-supplier=LCSC; ComponentLink2Description: https://datasheet.octopart.com:443/CRCW080522K0FKEAC-Vishay-datasheet-102570912.pdf?src-supplier=LCSC; ComponentLink3URL: https://datasheet.octopart.com:443/CRCW080522K0FKEAC-Vishay-datasheet-62316122.pdf?src-supplier=Future+Electronics; ComponentLink3Description: https://datasheet.octopart.com:443/CRCW080522K0FKEAC-Vishay-datasheet-62316122.pdf?src-supplier=Future+Electronics; ComponentLink4URL: http://sigma.octopart.com:80/rohs_statement/Vishay-company-15.pdf?src-supplier=Compliance+Statements; ComponentLink4Description: http://sigma.octopart.com:80/rohs_statement/Vishay-company-15.pdf?src-supplier=Compliance+Statements
U?#1-U?#7 = TLV9062IDR: IC OP AMP 2CH 8-SOIC; Slew Rate: 6.5V/µs; Number of Channels: 2; Input Offset Voltage (Vos): 300uV; Input Bias Current: 0.5pA; Output Current per Channel: 50mA; Gain Bandwidth Product: 10MHz; Operating Supply Current: 538uA; RoHS Compliant: Yes; Case/Package: SOIC; Number of Circuits: 2; Number of Pins: 8; Mount: Surface Mount; Max Operating Temperature: 125°C; Min Operating Temperature: -40°C; Packaging: Tape and Reel